# Altium project PCB_Project1.PrjPCB
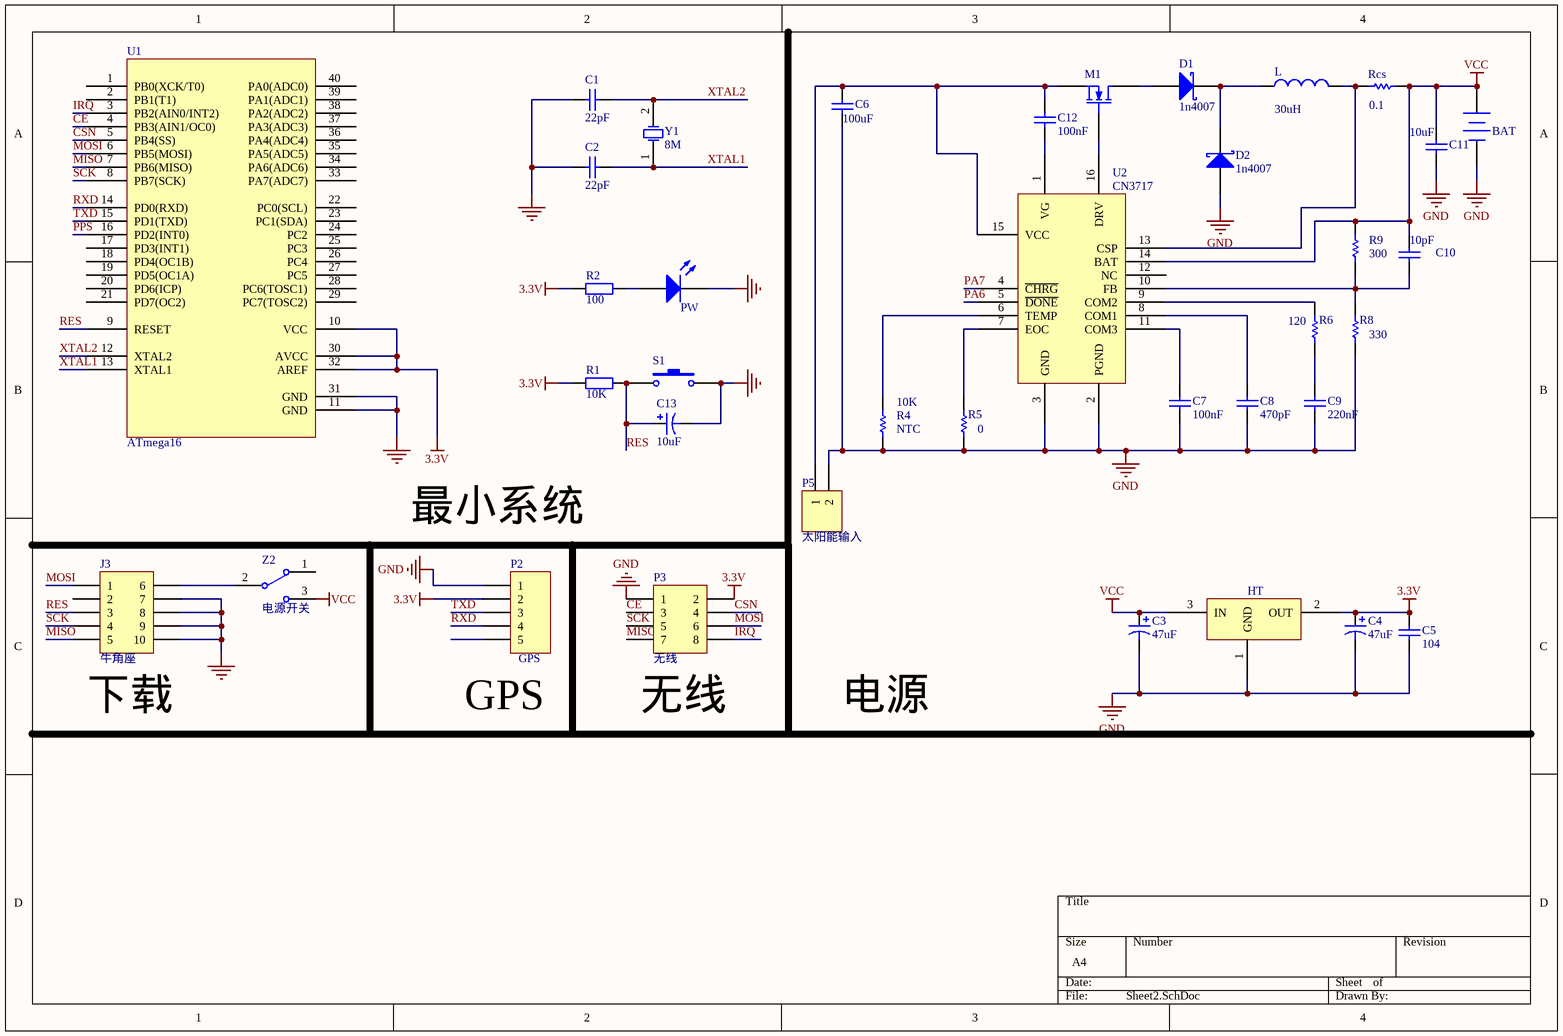
[diagram p0: Sheet2.SchDoc]
1 sheet, 37 parts. Net scope: global (net labels, ports and power ports of the same name join across sheets).
Board file: PCB1.PcbDoc

## Sheet Sheet2.SchDoc
size A4

### Parts
1117_3.3V  HT  [AMS1117-3.3V  SOT-223  贴片]
BAT  Battery  [大2端子]  (value not drawn)
C1  value 22pF  [电容CBB224(0.22)]
C2  value 22pF  [电容CBB224(0.22)]
C3  value 47uF  [电容]
C4  value 47uF  [电容]
C5  value 104  [电容CBB224(0.22)]  (hidden comment: Cap)
C6  value 100uF  [电容CBB224(0.22)]  (hidden comment: Cap)
C7  value 100nF  [电容CBB224(0.22)]  (hidden comment: Cap)
C8  value 470pF  [电容CBB224(0.22)]  (hidden comment: Cap)
C9  value 220nF  [电容CBB224(0.22)]  (hidden comment: Cap)
C10  value 10pF  [电容CBB224(0.22)]  (hidden comment: Cap)
C11  value 10uF  [电容CBB224(0.22)]  (hidden comment: Cap)
C12  value 100nF  [电容CBB224(0.22)]  (hidden comment: Cap)
C13  value 10uF  [电容]
D1  1n4007  [稳压二极管]
D2  1n4007  [稳压二极管]
J3  牛角座  [下载口（12345）]
L  value 30uH  [电感 直插]  (hidden comment: Inductor)
M1  MOSFET-N  [MOS管 贴片]  (value not drawn)
P2  GPS  [GPS模块]
P3  无线  [无线模块]
P5  太阳能输入  [大2端子]
PW  (no value)  [LED]
R1  value 10K  [0805]
R2  value 100  [0805]
R4  NTC  value 10K  [1206]
R5  value 0  [1206]  (hidden comment: Res1)
R6  value 120  [0805]  (hidden comment: Res1)
R8  value 330  [0805]  (hidden comment: Res1)
R9  value 300  [0805]  (hidden comment: Res1)
Rcs  value 0.1  [2512 贴片]  (hidden comment: Res1)
S1  (no value)  [4脚按键]
U1  ATmega16  [DIP 40 单片机]
U2  CN3717  [CN3717 贴片]
Y1  8M  [晶振]
Z2  电源开关  [自锁开关]

### Nets
3.3V: 1117_3.3V.2(OUT) C4.1 C5.1 P2.2 P3.2 R1.1 R2.1 U1.10(VCC) U1.30(AVCC) U1.32(AREF)
GND: 1117_3.3V.1(GND) BAT.2(-) C1.1 C2.1 C3.2 C4.2 C5.2 C6.1 C7.1 C8.1 C9.1 C11.1 C13.2 D2.1(A) J3.7 J3.8 J3.9 J3.10 P2.1 P3.1 P5.2 PW.2(K) R4.1 R5.1 R8.1 S1.2 U1.11(GND) U1.31(GND) U2.2(PGND) U2.3(GND)
VCC: 1117_3.3V.3(IN) BAT.1(+) C3.1 C10.2 C11.2 R9.2 Rcs.2 U2.14(BAT) Z2.3
CE: P3.3 U1.4(PB3(AIN1/OC0))
CSN: P3.4 U1.5(PB4(SS))
IRQ: P3.8 U1.3(PB2(AIN0/INT2))
MISO: J3.5 P3.7 U1.7(PB6(MISO))
MOSI: J3.1 P3.6 U1.6(PB5(MOSI))
PA6: U2.5(~{DONE})
PA7: U2.4(~{CHRG})
PPS: U1.16(PD2(INT0))
RES: C13.1 J3.3 R1.2 S1.1 U1.9(RESET)
RXD: P2.4 U1.14(PD0(RXD))
SCK: J3.4 P3.5 U1.8(PB7(SCK))
TXD: P2.3 U1.15(PD1(TXD))
XTAL1: C2.2 U1.13(XTAL1) Y1.1(OSC1)
XTAL2: C1.2 U1.12(XTAL2) Y1.2(OSC2)
NetC6_2: C6.2 C12.2 M1.3(S) P5.1 U2.15(VCC)
NetC7_2: C7.2 U2.11(COM3)
NetC8_2: C8.2 U2.8(COM1)
NetC9_2: C9.2 R6.1
NetC10_1: C10.1 R8.2 R9.1 U2.10(FB)
NetC12_1: C12.1 U2.1(VG)
NetD1_1: D1.1(A) M1.1(D)
NetD1_2: D1.2(K) D2.2(K) L.1
NetJ3_6: J3.6 Z2.2
NetL_2: L.2 Rcs.1 U2.13(CSP)
NetM1_2: M1.2(G) U2.16(DRV)
NetPW_1: PW.1(A) R2.2
NetR4_2: R4.2 U2.6(TEMP)
NetR5_2: R5.2 U2.7(EOC)
NetR6_2: R6.2 U2.9(COM2)

Not connected (* = marked no-connect by the designer): J3 2; P2 5; U1 1(PB0(XCK/T0)) 2(PB1(T1)) 17(PD3(INT1)) 18(PD4(OC1B)) 19(PD5(OC1A)) 20(PD6(ICP)) 21(PD7(OC2)) 22(PC0(SCL)) 23(PC1(SDA)) 24(PC2) 25(PC3) 26(PC4) 27(PC5) 28(PC6(TOSC1)) 29(PC7(TOSC2)) 33(PA7(ADC7)) 34(PA6(ADC6)) 35(PA5(ADC5)) 36(PA4(ADC4)) 37(PA3(ADC3)) 38(PA2(ADC2)) 39(PA1(ADC1)) 40(PA0(ADC0)); U2 12(NC); Z2 1

### Notes on the sheet
- 最小系统
- (near J3) 下载
- (near P2) GPS
- (near P3) 无线
- 电源

### Library data of the parts
1117_3.3V = Component_1
BAT = Battery: Multicell Battery; Published: 24-Mar-1999; LatestRevisionDate: 17-Jul-2002; LatestRevisionNote: Re-released for DXP Platform.; PackageReference: BAT-2; Publisher: Altium Limited
C1 C2 C5-C12 = Cap: Capacitor; Published: 8-Jun-2000; LatestRevisionDate: 17-Jul-2002; LatestRevisionNote: Re-released for DXP Platform.; PackageReference: RAD-0.3; Publisher: Altium Limited
C3 C4 C13 = Cap Pol3: Polarized Capacitor (Surface Mount); Published: 8-Jun-2000; LatestRevisionDate: 29-May-2009; LatestRevisionNote: IPC-7351 Footprint Added.; PackageReference: C0805; Publisher: Altium Limited; PackageDescription: Chip Capacitor
D1 D2 = D Schottky: Schottky Diode; Published: 8-Jun-2000; LatestRevisionDate: 17-Jul-2002; LatestRevisionNote: Re-released for DXP Platform.; PackageReference: SMB; Publisher: Altium Limited; Code_JEDEC: DO-214-AA
J3 = Header 5X2A: Header, 5-Pin, Dual row; LatestRevisionDate: 17-Jul-2002; LatestRevisionNote: Re-released for DXP Platform.; Publisher: Altium Limited
L = Inductor: Code_IEC: 1005; Published: 8-Jun-2000; LatestRevisionDate: 29-May-2009; LatestRevisionNote: IPC-7351 Footprint Added.; PackageReference: 0402-A; Publisher: Altium Limited; PackageDescription: Chip Inductor; Code_JEITA: 0402
M1 = MOSFET-N: N-Channel MOSFET; Published: 8-Jun-2000; LatestRevisionDate: 17-Jul-2002; LatestRevisionNote: Re-released for DXP Platform.; PackageVersion: 1995/1996; PackageReference: E3; Publisher: Altium Limited
P2 = Header 5: Header, 5-Pin; LatestRevisionDate: 17-Jul-2002; LatestRevisionNote: Re-released for DXP Platform.; Publisher: Altium Limited
P3 = Header 4X2: Header, 4-Pin, Dual row; LatestRevisionDate: 17-Jul-2002; LatestRevisionNote: Re-released for DXP Platform.; Publisher: Altium Limited
P5 = Header 2: Header, 2-Pin; LatestRevisionDate: 17-Jul-2002; LatestRevisionNote: Re-released for DXP Platform.; Publisher: Altium Limited
PW = LED0: Typical INFRARED GaAs LED; Published: 8-Jun-2000; LatestRevisionDate: 08-Jul-2005; LatestRevisionNote: Mech Layer 1 removed.; PackageReference: LED-0; Publisher: Altium Limited
R1 R2 = Res2: Resistor; Published: 8-Jun-2000; LatestRevisionDate: 17-Jul-2002; LatestRevisionNote: Re-released for DXP Platform.; PackageReference: AXIAL-0.4; Publisher: Altium Limited
R4-R6 R8 R9 Rcs = Res1: Resistor; Published: 8-Jun-2000; LatestRevisionDate: 17-Jul-2002; LatestRevisionNote: Re-released for DXP Platform.; PackageReference: AXIAL-0.3; Publisher: Altium Limited
S1 = SW-PB: Switch; Published: 24-Mar-1999; LatestRevisionDate: 17-Jul-2002; LatestRevisionNote: Re-released for DXP Platform.; PackageReference: SPST-2; Publisher: Altium Limited
U1 = Component_2
Y1 = XTAL: Crystal Oscillator; Published: 8-Jun-2000; LatestRevisionDate: 17-Jul-2002; LatestRevisionNote: Re-released for DXP Platform.; PackageReference: R38; Publisher: Altium Limited
Z2 = SW-SPDT: SPDT Subminiature Toggle Switch, Right Angle Mounting, Vertical Actuation; Published: 24-Mar-1999; LatestRevisionDate: 17-Dec-2003; LatestRevisionNote: Schematic revised, PCB Footprint replaced.; DatasheetVersion: 05-Dec-2000; PackageReference: TL36WW15050; Publisher: Altium Limited; ComponentLink1Description: Manufacturer Link; ComponentLink1URL: http://www.apem.com